# Altium schematic sheet CAN.SchDoc
size A4; SheetNumber: 5; SheetTotal: 7
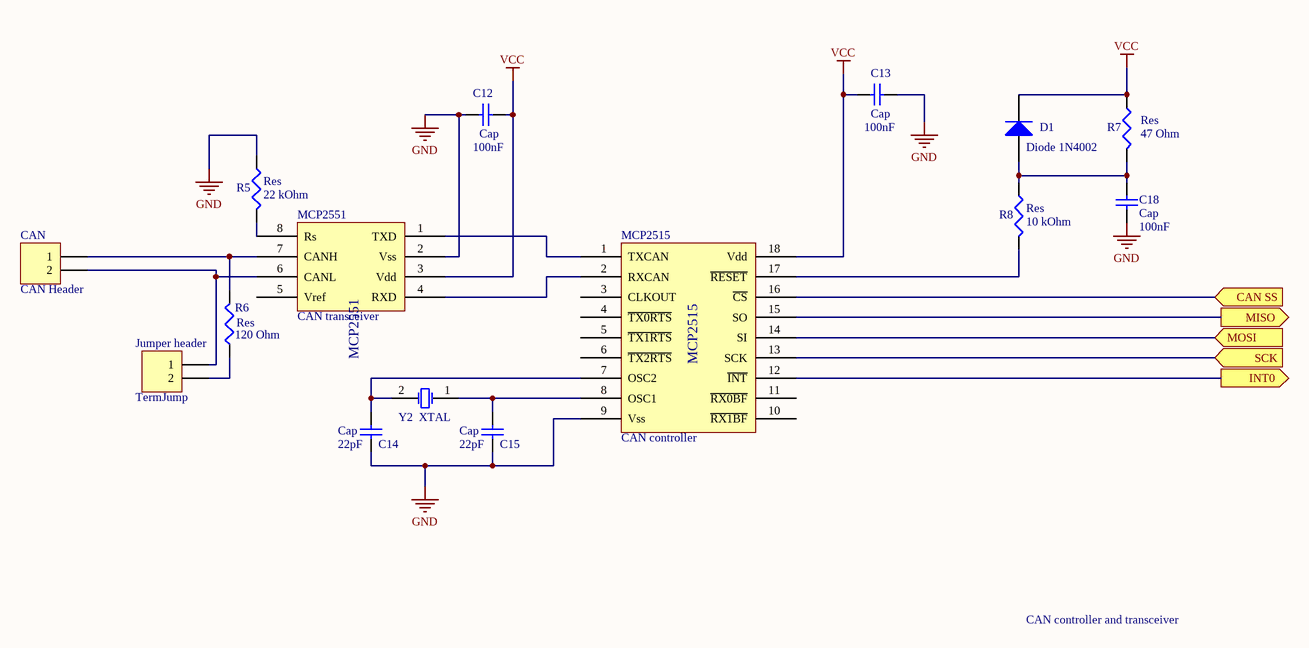
[diagram p0: CAN.SchDoc]

## Parts
C12  Cap  value 100nF  [C1210]
C13  Cap  value 100nF  [C1210]
C14  Cap  value 22pF  [C1210]
C15  Cap  value 22pF  [C1210]
C18  Cap  value 100nF  [C1210]
CAN  CAN Header  [HDR1X2]
D1  Diode 1N4002  [DO-41]
MCP2515  CAN controller  [MCP2515 SOIC 18-PIN]
MCP2551  CAN transceiver  [MACP2551 SOIC 8-PIN]
R5  Res  value 22 kOhm  [14-1210]
R6  Res  value 120 Ohm  [14-1210]
R7  Res  value 47 Ohm  [14-1210]
R8  Res  value 10 kOhm  [14-1210]
TermJump  Jumper header  [HDR1X2]
Y2  XTAL  [R38]

## Ports
CAN SS (in), INT0 (out), MISO (out), MOSI (in), SCK (in)

## Nets
GND: C12.2 C13.1 C14.2 C15.2 C18.2 MCP2515.9(Vss) MCP2551.2(Vss) R5.1
VCC: C12.1 C13.2 D1.2(K) MCP2515.18(Vdd) MCP2551.3(Vdd) R7.1
CAN SS: MCP2515.16(~{CS}) ; port CAN SS
INT0: MCP2515.12(~{INT}) ; port INT0
MISO: MCP2515.15(SO) ; port MISO
MOSI: MCP2515.14(SI) ; port MOSI
SCK: MCP2515.13(SCK) ; port SCK
NetC14_1: C14.1 MCP2515.7(OSC2) Y2.2(OSC2)
NetC15_1: C15.1 MCP2515.8(OSC1) Y2.1(OSC1)
NetC18_1: C18.1 D1.1(A) R7.2 R8.1
NetCAN_1: CAN.1 MCP2551.7(CANH) R6.2
NetCAN_2: CAN.2 MCP2551.6(CANL) TermJump.1
NetMCP2515_1: MCP2515.1(TXCAN) MCP2551.1(TXD)
NetMCP2515_2: MCP2515.2(RXCAN) MCP2551.4(RXD)
NetMCP2515_17: MCP2515.17(~{RESET}) R8.2
NetMCP2551_8: MCP2551.8(Rs) R5.2
NetR6_1: R6.1 TermJump.2

Not connected (* = marked no-connect by the designer): MCP2515 3(CLKOUT) 4(~{TX0RTS}) 5(~{TX1RTS}) 6(~{TX2RTS}) 10(~{RX1BF}) 11(~{RX0BF}); MCP2551 5(Vref)

## Notes on the sheet
- CAN controller and transceiver
- Title:
- Course:
- TTK4155 Industrielle og innbygde datasystemers kontruksjon
- Size:
- Date:
- Author:
- A4
- Moltumyr, Andreas Hanssen
- Number:
- Time:
- Revision:
- Sheet
- of
- File:

## Library data of the parts
C12-C15 C18 = Cap Semi: Capacitor (Semiconductor SIM Model); Published: 8-Jun-2000; LatestRevisionDate: 29-May-2009; LatestRevisionNote: IPC-7351 Footprint Added.; PackageReference: C1206; Publisher: Altium Limited; PackageDescription: Chip Capacitor
CAN TermJump = Header 2: Header, 2-Pin; LatestRevisionDate: 17-Jul-2002; LatestRevisionNote: Re-released for DXP Platform.; Publisher: Altium Limited
D1 = Diode 1N4002: 1 Amp General Purpose Rectifier; Published: 8-Jun-2000; LatestRevisionDate: 17-Jul-2002; LatestRevisionNote: Re-released for DXP Platform.; DatasheetVersion: 1998; PackageVersion: Aug-1999; PackageReference: DO-41; Publisher: Altium Limited; PackageDescription: Diode, Axial; Body 5.2 x 2.7 mm (LxDia. max), Lead Dia. 0.86 mm (max); Code_JEDEC: DO-204-AL; ComponentLink1Description: Manufacturer Link; ComponentLink1URL: http://www.fairchildsemi.com/; ComponentLink2Description: Datasheet; ComponentLink2URL: http://www.fairchildsemi.com/ds/1N%2F1N4001.pdf
MCP2515 = MCP2515
MCP2551 = MCP2551
R5-R8 = Res3: Resistor; Published: 8-Jun-2000; LatestRevisionDate: 29-May-2009; LatestRevisionNote: IPC-7351 Footprint Added.; PackageReference: J1-0603; Publisher: Altium Limited; PackageDescription: Chip Resistor
Y2 = XTAL: Crystal Oscillator; Published: 8-Jun-2000; LatestRevisionDate: 17-Jul-2002; LatestRevisionNote: Re-released for DXP Platform.; PackageReference: R38; Publisher: Altium Limited; PackageDescription: Crystal, Thru-Hole; 2 Leads; Body 3.1 x 8.2 mm (Dia.xH)